# EasyEDA Pro project ProPrj_haxmasday2_2025-12-15.epro

# Schematic Schematic1
Board Name: Board1; Create Date: 2025-12-15; Page Name: P1; Project Name: haxmasday2; Schematic Name: Schematic1; Update Date: 2025-12-15; Company: EasyEDA.com; Page Size: A4; Version: V1.0
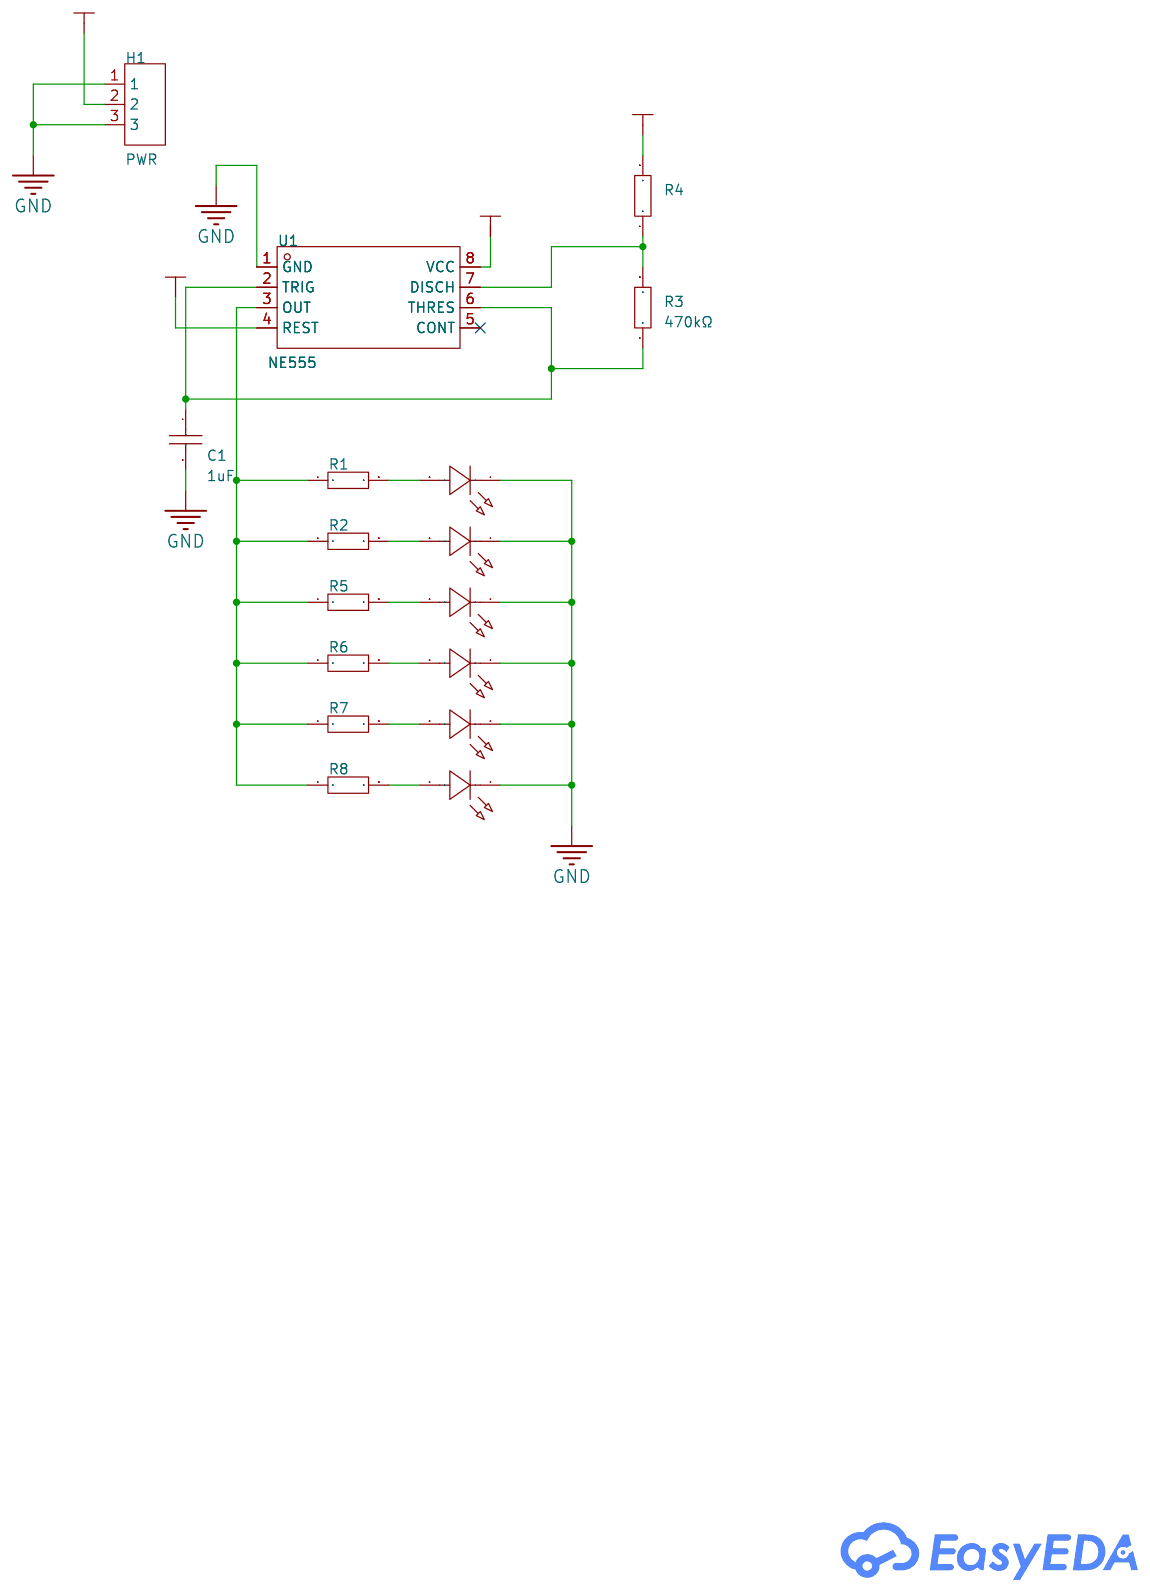
[diagram p0: schematic sheet]

## Parts
C1  1uF  [CAP-TH_L7.3-W4.5-P5.00-D0.5]
H1  PWR  [HDR-TH_3P-P2.54-V-M-1]
LED1  XL-302SURD  [LED-TH_BD3.8-P2.54-RD]
LED2  XL-302SURD  [LED-TH_BD3.8-P2.54-RD]
LED3  XL-302SURD  [LED-TH_BD3.8-P2.54-RD]
LED4  XL-302SURD  [LED-TH_BD3.8-P2.54-RD]
LED5  XL-302SURD  [LED-TH_BD3.8-P2.54-RD]
LED6  XL-302SURD  [LED-TH_BD3.8-P2.54-RD]
R1  1kΩ  [RES-TH_BD2.5-L6.5-P10.50-D0.6]
R2  1kΩ  [RES-TH_BD2.5-L6.5-P10.50-D0.6]
R3  470kΩ  [RES-TH_BD2.2-L6.5-P10.50-D0.6]
R4  1kΩ  [RES-TH_BD2.5-L6.5-P10.50-D0.6]
R5  1kΩ  [RES-TH_BD2.5-L6.5-P10.50-D0.6]
R6  1kΩ  [RES-TH_BD2.5-L6.5-P10.50-D0.6]
R7  1kΩ  [RES-TH_BD2.5-L6.5-P10.50-D0.6]
R8  1kΩ  [RES-TH_BD2.5-L6.5-P10.50-D0.6]
U1  NE555  [DIP-8_L9.7-W6.4-P2.54-LS7.6-BL]

## Library data of the parts
C1 = B32529C0105J289: Capacitance:1uF Tolerance:±5% Tolerance:±5% Voltage Rating:63V Dielectric Material:Metallized Polyester Operating Temperature:-55℃~+125℃ Operating Temperature:-55℃~+125℃; LCSC Part Name: 1uF ±5% 63V; Supplier Part: C125386; Manufacturer: TDK; Supplier Footprint: 插件,P=5mm; Datasheet: https://item.szlcsc.com/datasheet/B32529C0105J289/136663.html; Supplier: LCSC; Tolerance: ±5%; Voltage Rating: 63V; Dielectric Material: Metallized Polyester; Operating Temperature: -55℃~+125℃
H1 = HX PH254-01-03-Z-L11.5 pcb pin header: Pin Structure:1x3P Pitch:2.54mm Circluar Pins/Square Pins:Pin Header Mounting Type:Through Hole Number of Rows:1 Number of Pins:3P Current Rating:3A Voltage Rating (Max):1kV Length of Mating Pin:6mm Insulation Height:2.5mm Length of End Connection Pin:3mm; LCSC Part Name: 1x3P 间距:2.54mm 方针 直插; Supplier Part: C52016391; Manufacturer: hanxia(韩下); Supplier Footprint: 插件,P=2.54mm; JLCPCB Part Class: Extended Part; Datasheet: https://item.szlcsc.com/datasheet/HX%2520PH254-01-03-Z-L11.5%2520pcb%2520pin%2520header/54760436.html; Supplier: LCSC; Pin Structure: 1x3P; Pitch: 2.54mm; Circluar Pins/Square Pins: Pin Header; Mounting Type: Through Hole; Number of Rows: 1; Number of Pins: 3P; Current Rating: 3A; Voltage Rating (Max): 1kV; Length of Mating Pin: 6mm; Insulation Height: 2.5mm; Length of End Connection Pin: 3mm; Contact Material: Brass; Contact Plating: Gold; Operating Temperature: -40℃~+105℃
LED1-LED6 = XL-302SURD: Lamp Holder Type:3mm Round Lens Illumination Color:Red Voltage - Forward(Vf):2.2V Voltage - Forward(Vf):2.2V Power(Watts):50mW Forward Current:20mA Wavelength - Dominant:620nm~630nm Wavelength - Dominant:620nm~630nm Peak Wavelength:625nm Diode Configurati; LCSC Part Name: 3mm圆形灯头 红色; Supplier Part: C2895470; Manufacturer: XINGLIGHT(成兴光); Supplier Footprint: 插件,D=3mm; Datasheet: https://item.szlcsc.com/datasheet/XL-302SURD/3136185.html; Supplier: LCSC; Lamp Holder Type: 3mm Round Lens; Illumination Color: Red; Voltage - Forward(Vf): 2.2V; Power(Watts): 50mW; Forward Current: 20mA; Wavelength - Dominant: 620nm~630nm; Peak Wavelength: 625nm; Lens Color: Red Lens; Luminous Intensity: 1000mcd; Viewing Angle: 35°; Operating Temperature: -20℃~+85℃
R1 R2 R4-R8 = MFR0W4F1001A50: Type:Metal Film Resistors Resistance:1kΩ Tolerance:±1% Tolerance:±1% Voltage-Supply(Max):250V Power(Watts):250mW Temperature Coefficient:±50ppm/℃ Temperature Coefficient:±50ppm/℃; LCSC Part Name: 1kΩ ±1% 250mW 金属膜电阻 铜脚，圆柱状直插; Supplier Part: C57435; Manufacturer: UNI-ROYAL(厚声); Supplier Footprint: 插件,D2.2xL6.5mm; JLCPCB Part Class: Extended Part; Datasheet: https://atta.szlcsc.com/upload/public/pdf/source/20191012/C436293_8820AA14BC71FA35E551C06C441482A0.pdf; Supplier: LCSC; Type: Metal Film Resistors; Tolerance: ±1%; Voltage-Supply(Max): 250V; Power(Watts): 250mW; Temperature Coefficient: ±50ppm/℃
R3 = MFR50SJT-52-470K: Type:Metal Film Resistors Resistance: Tolerance:±5% Tolerance:±5% Power(Watts):500mW Operating Temperature:-55℃~+155℃ Operating Temperature:-55℃~+155℃; LCSC Part Name: 金属膜电阻 470kΩ ±5% 500mW 小体积，铜脚，圆柱状直插; Supplier Part: C176640; Manufacturer: YAGEO(国巨); Supplier Footprint: 插件,D2.4xL6.3mm; JLCPCB Part Class: Extended Part; Datasheet: https://atta.szlcsc.com/upload/public/pdf/source/20191118/C457825_18355E864DE4965678DC27B0EBC3E21E.pdf; Supplier: LCSC; Type: Metal Film Resistors; Tolerance: ±5%; Power(Watts): 500mW; Operating Temperature: -55℃~+155℃
U1 = NE555: Supplier Part: C504550; Supplier Footprint: DIP-8; JLCPCB Part Class: Extended Part; Supplier: LCSC

## Nets
9V: H1.2 R4.2 U1.4(REST) U1.8(VCC)
GND: C1.2 H1.1 H1.3 LED1.1(K) LED2.1(K) LED3.1(K) LED4.1(K) LED5.1(K) LED6.1(K) U1.1(GND)
$1N985: LED2.2(A) R2.2
$1N989: LED1.2(A) R1.2
$1N995: R1.1 R2.1 R5.1 R6.1 R7.1 R8.1 U1.3(OUT)
$1N1207: R3.2 R4.1 U1.7(DISCH)
$1N1217: C1.1 R3.1 U1.2(TRIG) U1.6(THRES)
$1N1466: LED4.2(A) R6.2
$1N1468: LED3.2(A) R5.2
$1N1643: LED6.2(A) R8.2
$1N1645: LED5.2(A) R7.2

Not connected (* = marked no-connect by the designer): U1 5(CONT)*

# Board PCB1
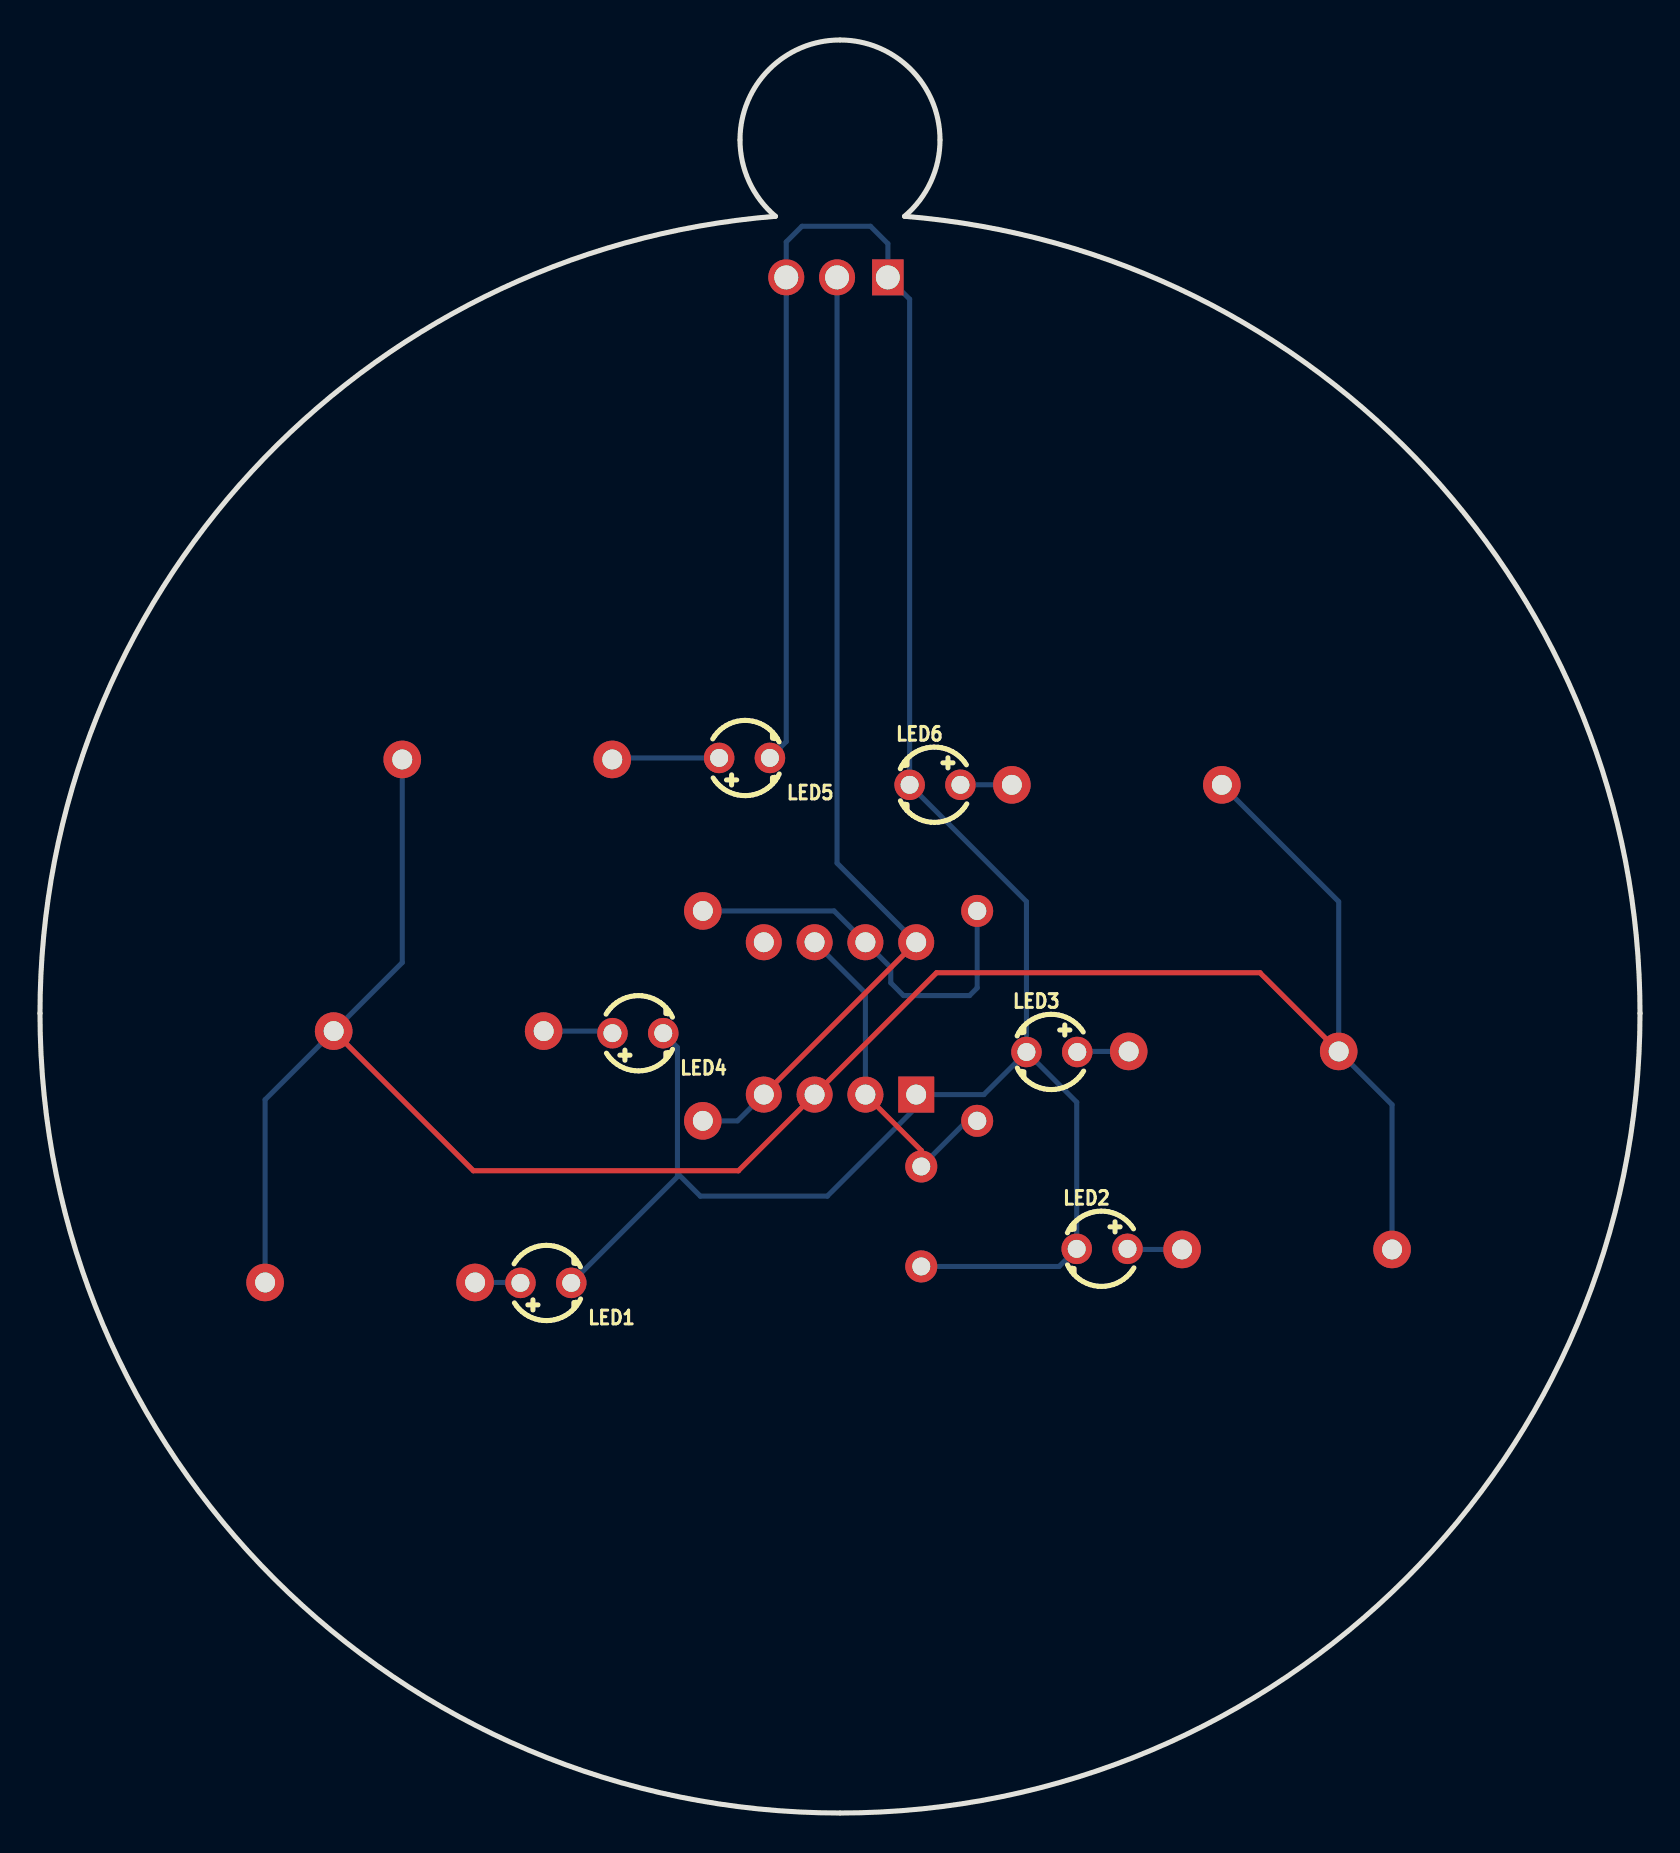
[diagram p1: board, top side]
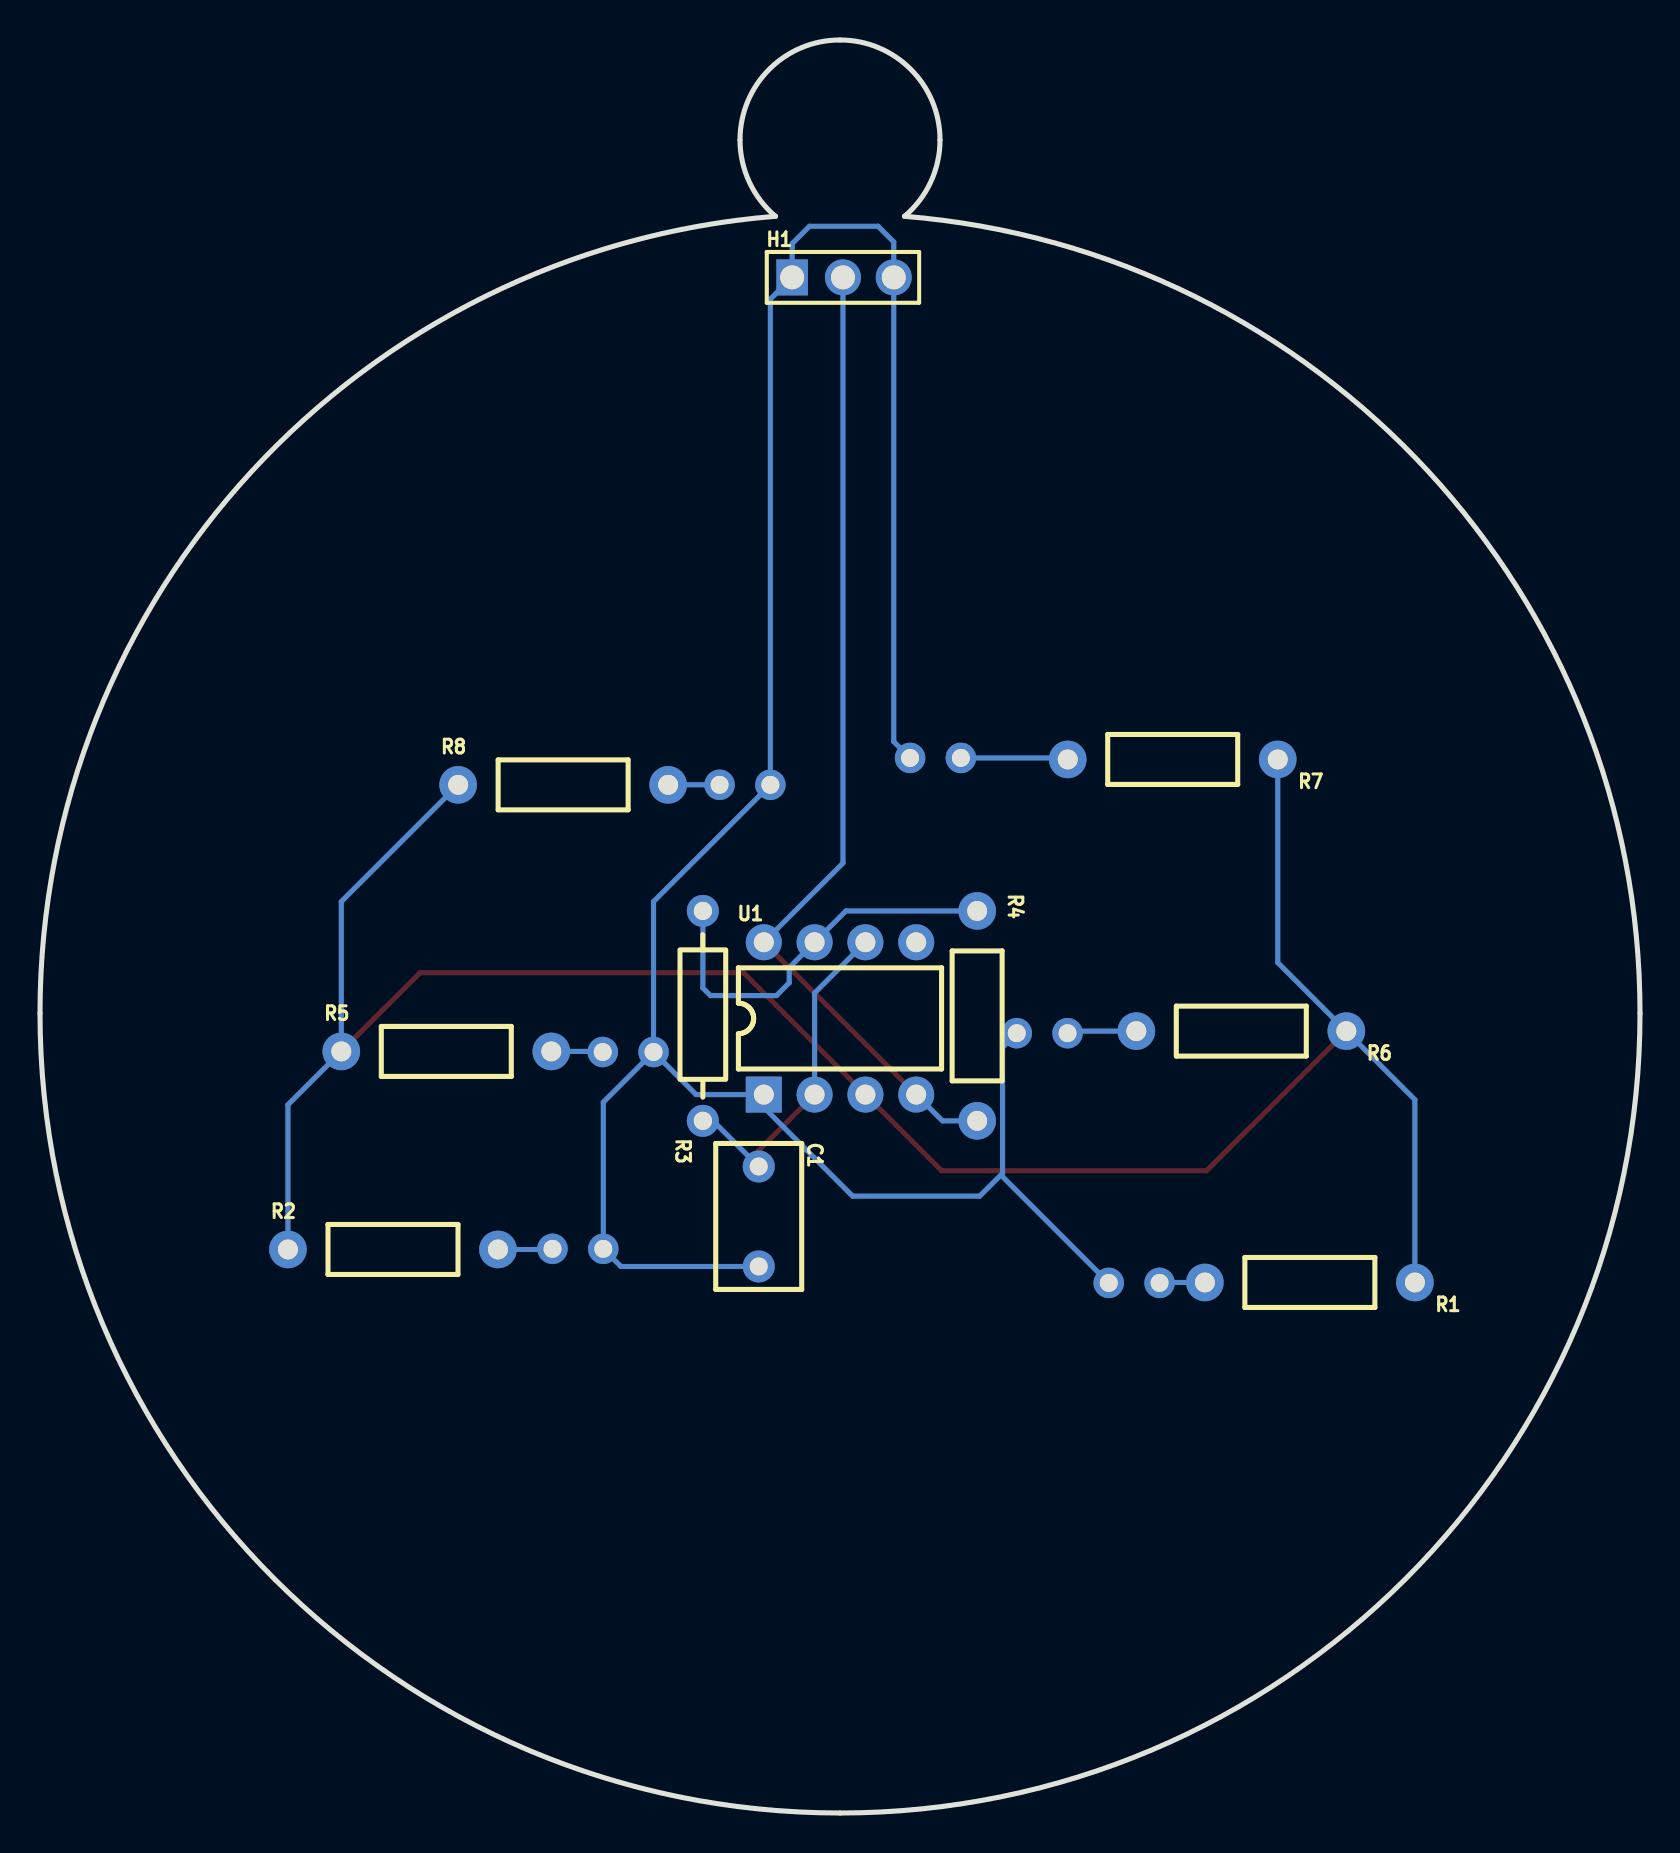
[diagram p2: board, bottom side, seen from below]

Outline 80 x 88.69 mm; copper layers: Top Layer, Bottom Layer. Coordinates in mm from the lower left corner of the outline.
Outline path: 0,40 arc(10.6,67.12) 36.77,79.87 arc(35.46,81.58) 35,83.69 arc(36.46,87.22) 40,88.69 arc(43.54,87.22) 45,83.69 arc(44.54,81.58) 43.23,79.87 arc(69.4,67.12) 80,40 arc(68.28,11.72) 40,0 arc(11.72,11.72) 0,40
Stack: Top Layer 0.035mm / Dielectric1 1.51mm FR4 er 4.5 / Bottom Layer 0.035mm

## Design rules (mm)
template: JLCPCB Capability(Two Layers Board)
spacing copperThickness1oz (default): track to track 0.102, other pairs 0.152 to 0.3
spacing copperThickness2oz: track to track 0.203, other pairs 0.152 to 0.3
track width copperThickness1oz (default): min 0.127, default 0.254, max 2.54
track width copperThickness2oz: min 0.203, default 0.254, max 2.54
differential pair differentialPair (default): width min 0.127, default 0.254, max 2.54; gap min 0.152, default 0.152
via viaSize (default): diameter min 0.5, default 0.61, max 10; hole min 0.3, default 0.305, max 6.3

## Placement (name value [footprint] x y rotation side)
C1  1uF  [CAP-TH_L7.3-W4.5-P5.00-D0.5]  44.06 29.84 270 bottom
H1  PWR  [HDR-TH_3P-P2.54-V-M-1]  39.85 76.81 180 bottom
LED1  XL-302SURD  [LED-TH_BD3.8-P2.54-RD]  25.29 26.52 180 top
LED2  XL-302SURD  [LED-TH_BD3.8-P2.54-RD]  53.11 28.22 0 top
LED3  XL-302SURD  [LED-TH_BD3.8-P2.54-RD]  50.59 38.07 0 top
LED4  XL-302SURD  [LED-TH_BD3.8-P2.54-RD]  29.89 39.01 180 top
LED5  XL-302SURD  [LED-TH_BD3.8-P2.54-RD]  35.23 52.78 180 top
LED6  XL-302SURD  [LED-TH_BD3.8-P2.54-RD]  44.75 51.43 0 top
R1  1kΩ  [RES-TH_BD2.5-L6.5-P10.50-D0.6]  16.51 26.54 0 bottom
R2  1kΩ  [RES-TH_BD2.5-L6.5-P10.50-D0.6]  62.35 28.19 180 bottom
R3  470kΩ  [RES-TH_BD2.2-L6.5-P10.50-D0.6]  46.86 39.87 90 bottom
R4  1kΩ  [RES-TH_BD2.5-L6.5-P10.50-D0.6]  33.14 39.87 270 bottom
R5  1kΩ  [RES-TH_BD2.5-L6.5-P10.50-D0.6]  59.69 38.09 180 bottom
R6  1kΩ  [RES-TH_BD2.5-L6.5-P10.50-D0.6]  19.93 39.11 0 bottom
R7  1kΩ  [RES-TH_BD2.5-L6.5-P10.50-D0.6]  23.36 52.7 0 bottom
R8  1kΩ  [RES-TH_BD2.5-L6.5-P10.50-D0.6]  53.84 51.43 180 bottom
U1  NE555  [DIP-8_L9.7-W6.4-P2.54-LS7.6-BL]  40 39.75 180 bottom

## Footprints (pads in the part's own frame, mm; a bottom-side part is the same pattern mirrored in y, then rotated)
CAP-TH_L7.3-W4.5-P5.00-D0.5
  round 1.6 hole 0.9: 1(-2.5,0) 2(2.5,0)
DIP-8_L9.7-W6.4-P2.54-LS7.6-BL
  rect 1.8x1.8 hole 1: 1(-3.81,-3.81)
  round 1.8 hole 1: 2(-1.27,-3.81) 3(1.27,-3.81) 4(3.81,-3.81) 5(3.81,3.81) 6(1.27,3.81) 7(-1.27,3.81) 8(-3.81,3.81)
HDR-TH_3P-P2.54-V-M-1
  rect 1.575x1.8 hole 1.2: 1(-2.54,0)
  round 1.8 hole 1.2: 2(0,0) 3(2.54,0)
LED-TH_BD3.8-P2.54-RD
  round 1.524 hole 0.9: 1(-1.27,0) 2(1.27,0)
RES-TH_BD2.2-L6.5-P10.50-D0.6
  round 1.6 hole 0.914: 1(-5.25,0) 2(5.25,0)
RES-TH_BD2.5-L6.5-P10.50-D0.6
  round 1.879 hole 1: 1(-5.25,0) 2(5.25,0)

## Nets
As in the schematic.

Pads without a net: U1 5

## Routing (per net, layer and track width the routed paths; a pad name or vN(x,y) marks a point on that pad's centre or on a via; arc(x,y) is an arc through that point)
9V: length 49.3
  Top Layer w0.254: U1.8 U1.4
  Bottom Layer w0.254: R4.2 34.88,34.62 U1.4 ; U1.8 39.85,47.51 H1.2
GND: length 130.5
  Bottom Layer w0.254: 31.87,32 33.02,30.86 39.36,30.86 43.81,35.3 U1.1 47.19,35.94 LED3.1 ; 31.87,32 31.87,38.3 LED4.1 ; 31.87,32 31.87,31.83 LED1.1 ; LED3.1 49.32,45.59 LED6.1 43.48,75.72 H1.1 42.39,78.5 41.52,79.37 38.1,79.37 37.31,78.59 H1.3 37.31,53.59 LED5.1 ; LED3.1 51.84,35.55 LED2.1 50.95,27.34 C1.2
$1N985: length 2.7
  Bottom Layer w0.254: R2.2 54.41,28.19 LED2.2
$1N989: length 2.3
  Bottom Layer w0.254: LED1.2 24,26.54 R1.2
$1N995: length 114.6
  Top Layer w0.254: R6.1 21.67,32.13 34.92,32.13 U1.3 44.83,42.03 61,42.03 R5.1
  Bottom Layer w0.254: R1.1 11.26,35.68 R6.1 18.11,42.54 R7.1 ; R2.1 67.6,35.43 R5.1 64.94,45.59 R8.1
$1N1207: length 19.9
  Bottom Layer w0.254: R4.1 39.7,45.12 42.54,42.29 42.54,41.52 43.17,40.89 46.48,40.89 46.86,41.27 R3.2
$1N1217: length 17.2
  Top Layer w0.254: 41.27,35.94 44.06,33.14 C1.1
  Bottom Layer w0.254: 41.27,35.94 41.27,41.02 U1.6 ; R3.1 46.35,34.62 C1.1
$1N1466: length 3.5
  Bottom Layer w0.254: R6.2 28.52,39.11 LED4.2
$1N1468: length 2.6
  Bottom Layer w0.254: R5.2 51.89,38.09 LED3.2
$1N1643: length 2.6
  Bottom Layer w0.254: 48.59,51.43 LED6.2
$1N1645: length 5.4
  Bottom Layer w0.254: LED5.2 28.69,52.78 R7.2
